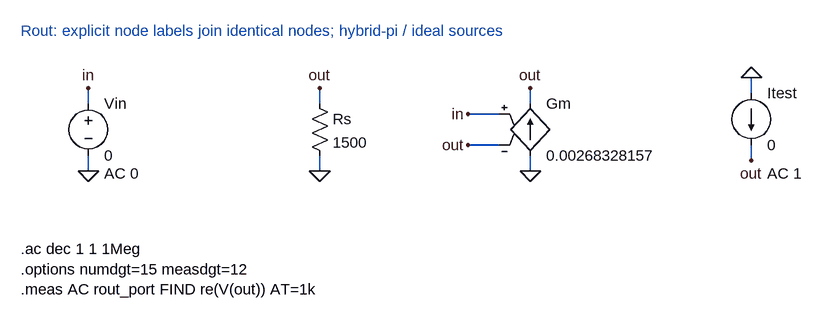
[diagram p0: schematic Rout.asc]
Rout.asc, the LTspice schematic file:
Version 4
SHEET 1 1800 1500
TEXT 16 -48 Left 2 ;Rout: explicit node labels join identical nodes; hybrid-pi / ideal sources
WIRE 120 64 120 40
FLAG 120 40 in
WIRE 120 144 120 168
FLAG 120 168 0
SYMBOL voltage 120 48 R0
SYMATTR InstName Vin
WINDOW 123 24 124 Left 2
SYMATTR Value 0
SYMATTR Value2 AC 0
WIRE 476 64 476 40
FLAG 476 40 out
WIRE 476 144 476 168
FLAG 476 168 0
SYMBOL res 460 48 R0
SYMATTR InstName Rs
SYMATTR Value 1500
WIRE 800 144 800 168
FLAG 800 168 0
WIRE 800 64 800 40
FLAG 800 40 out
WIRE 752 80 704 80
FLAG 704 80 in
WIRE 752 128 704 128
FLAG 704 128 out
SYMBOL g 800 48 R0
SYMATTR InstName Gm
SYMATTR Value 0.00268328157
WIRE 1140 48 1140 24
FLAG 1140 24 0
WIRE 1140 128 1140 152
FLAG 1140 152 out
SYMBOL current 1140 48 R0
SYMATTR InstName Itest
WINDOW 123 24 124 Left 2
SYMATTR Value 0
SYMATTR Value2 AC 1
TEXT 16 288 Left 2 !.ac dec 1 1 1Meg\n.options numdgt=15 measdgt=12\n.meas AC rout_port FIND re(V(out)) AT=1k

The netlist it stands for:
* Rout.asc
Vin in 0 0 AC 0
Rs out 0 1500
Gm 0 out in out 0.00268328157
Itest 0 out 0 AC 1
* Rout: explicit node labels join identical nodes; hybrid-pi / ideal sources
.ac dec 1 1 1Meg
.options numdgt=15 measdgt=12
.meas AC rout_port FIND re(V(out)) AT=1k
.backanno
.end

* Results of the author's LTspice run, read from the files saved beside the schematic
* From the log:
*   rout_port: re(V(out))=(49.4992380724dB,0°) at 1000